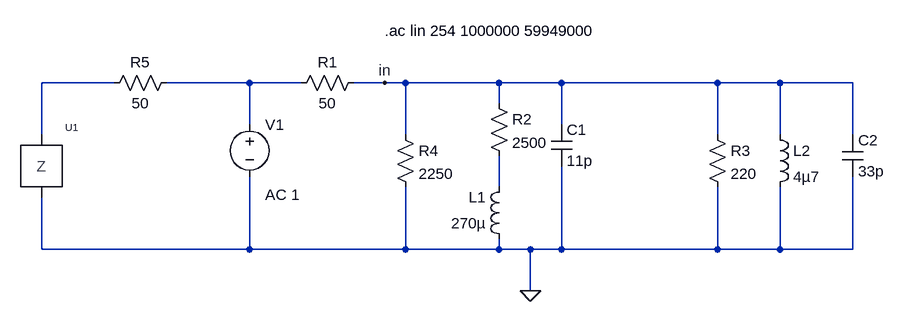
[diagram p0: schematic Open Port Model with Test Load.asc]
Open Port Model with Test Load.asc, the LTspice schematic file:
Version 4
SHEET 1 1144 884
WIRE -48 64 -160 64
WIRE 160 64 32 64
WIRE 240 64 160 64
WIRE 368 64 320 64
WIRE 400 64 368 64
WIRE 544 64 400 64
WIRE 640 64 544 64
WIRE 880 64 640 64
WIRE 976 64 880 64
WIRE 1088 64 976 64
WIRE 544 96 544 64
WIRE 160 128 160 64
WIRE 640 128 640 64
WIRE -160 144 -160 64
WIRE 400 144 400 64
WIRE 880 144 880 64
WIRE 976 144 976 64
WIRE 1088 144 1088 64
WIRE 544 224 544 176
WIRE -160 320 -160 240
WIRE 160 320 160 208
WIRE 160 320 -160 320
WIRE 400 320 400 224
WIRE 400 320 160 320
WIRE 544 320 544 304
WIRE 544 320 400 320
WIRE 592 320 544 320
WIRE 640 320 640 192
WIRE 640 320 592 320
WIRE 880 320 880 224
WIRE 880 320 640 320
WIRE 976 320 976 224
WIRE 976 320 880 320
WIRE 1088 320 1088 208
WIRE 1088 320 976 320
WIRE 592 384 592 320
FLAG 592 384 0
FLAG 368 64 in
SYMBOL ind 560 320 R180
WINDOW 0 36 80 Left 2
WINDOW 3 36 40 Left 2
SYMATTR InstName L1
SYMATTR Value 270µ
SYMATTR SpiceLine Rser=0.5
SYMBOL cap 624 128 R0
SYMATTR InstName C1
SYMATTR Value 11p
SYMBOL res 528 80 R0
SYMATTR InstName R2
SYMATTR Value 2500
SYMBOL res 384 128 R0
SYMATTR InstName R4
SYMATTR Value 2250
SYMBOL voltage 160 112 R0
WINDOW 123 24 124 Left 2
WINDOW 39 0 0 Left 0
SYMATTR Value2 AC 1
SYMATTR InstName V1
SYMATTR Value ""
SYMBOL res 336 48 R90
WINDOW 0 0 56 VBottom 2
WINDOW 3 32 56 VTop 2
SYMATTR InstName R1
SYMATTR Value 50
SYMBOL ind 960 128 R0
SYMATTR InstName L2
SYMATTR Value 4µ7
SYMBOL cap 1072 144 R0
SYMATTR InstName C2
SYMATTR Value 33p
SYMBOL res 864 128 R0
SYMATTR InstName R3
SYMATTR Value 220
SYMBOL res 48 48 R90
WINDOW 0 0 56 VBottom 2
WINDOW 3 32 56 VTop 2
SYMATTR InstName R5
SYMATTR Value 50
SYMBOL TestLoad1 -160 192 R0
SYMATTR InstName U1
TEXT 368 -16 Left 2 !.ac lin 254 1000000 59949000

The netlist it stands for:
* Open Port Model with Test Load.asc
L1 0 N003 270µ Rser=0.5
C1 in 0 11p
R2 in N003 2500
R4 in 0 2250
V1 N002 0 AC 1
R1 in N002 50
L2 in 0 4µ7
C2 in 0 33p
R3 in 0 220
R5 N002 N001 50
XU1 N001 0 TestLoad1  ; pins 1 2
.ac lin 254 1000000 59949000
.lib TestLoad1.sub
.backanno
.end